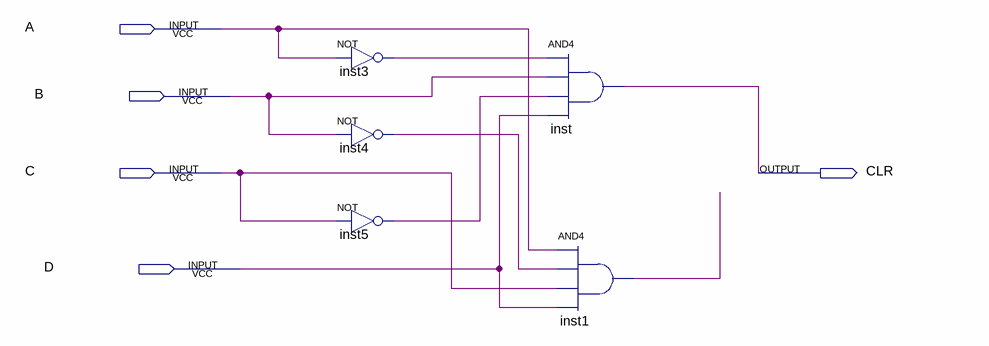
[diagram p0: schematic sheet]
// Quartus schematic CLR_st.bdf as structural Verilog: 5 symbols, 5 pins
module CLR_st (
  input  A,
  input  B,
  input  C,
  input  D,
  output CLR
);

  wire inst1_out, inst3_out, inst4_out, inst5_out;

  not inst3 (inst3_out, A);
  not inst4 (inst4_out, B);
  not inst5 (inst5_out, C);
  and inst (CLR, inst3_out, B, inst5_out, D);
  and inst1 (inst1_out, A, inst4_out, C, D);
endmodule
